# Altium project PowerSupplyPE.PrjPcb
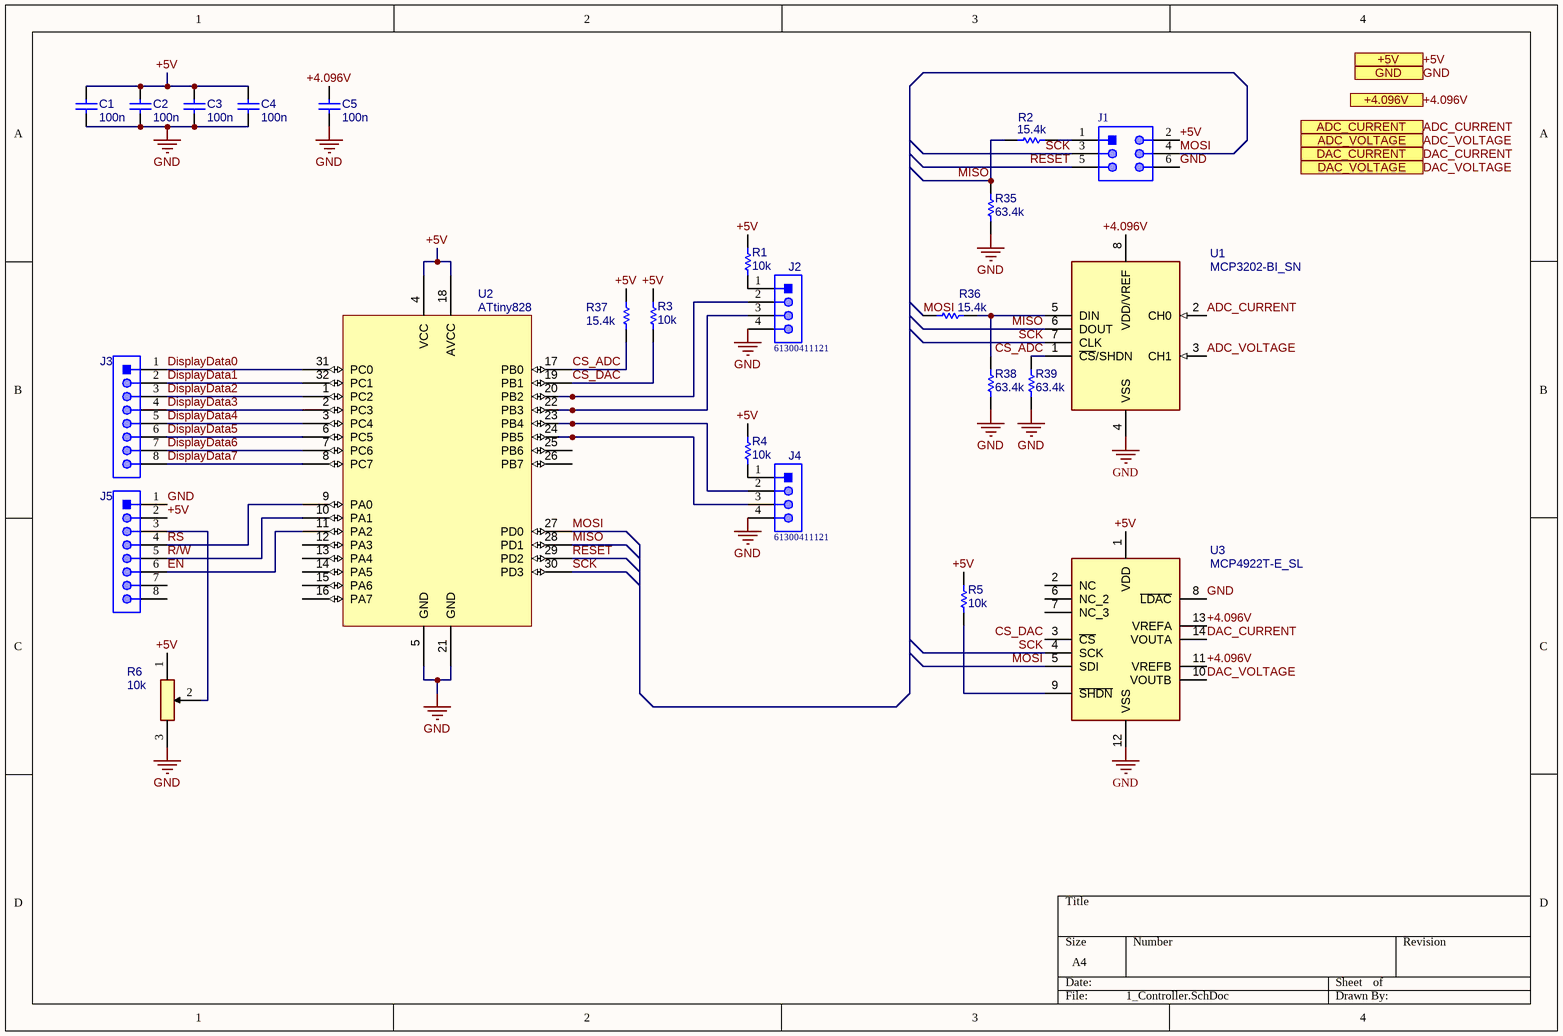
[diagram p0: 1_Controller.SchDoc]
2 sheets, 92 parts. Net scope: flat (ports and power ports of the same name join across sheets).
Board file: PCB1.PcbDoc
Sheets:
  1_Controller.SchDoc
  2_PSU.SchDoc

## Sheet 1_Controller.SchDoc
size A4; SheetNumber: 1; SheetTotal: 2

### Parts
C1  value 100n  [6-0805_N]  (hidden comment: Capacitor)
C2  value 100n  [6-0805_N]  (hidden comment: Capacitor)
C3  value 100n  [6-0805_N]  (hidden comment: Capacitor)
C4  value 100n  [6-0805_N]  (hidden comment: Capacitor)
C5  value 100n  [6-0805_N]  (hidden comment: Capacitor)
J1  61300621121  [61300621121]  (value not drawn)
J2  61300411121  [61300411121]
J3  61300811121  [61300811121]  (value not drawn)
J4  61300411121  [61300411121]
J5  61300811121  [61300811121]  (value not drawn)
R1  value 10k  [6-0805_N]  (hidden comment: Resistor)
R2  value 15.4k  [6-0805_N]  (hidden comment: Resistor)
R3  value 10k  [6-0805_N]  (hidden comment: Resistor)
R4  value 10k  [6-0805_N]  (hidden comment: Resistor)
R5  value 10k  [6-0805_N]  (hidden comment: Resistor)
R6  10k  [PV36W201C01B00]
R35  value 63.4k  [6-0805_N]  (hidden comment: Resistor)
R36  value 15.4k  [6-0805_N]  (hidden comment: Resistor)
R37  value 15.4k  [6-0805_N]  (hidden comment: Resistor)
R38  value 63.4k  [6-0805_N]  (hidden comment: Resistor)
R39  value 63.4k  [6-0805_N]  (hidden comment: Resistor)
U1  MCP3202-BI_SN  [SOIC127P600X175-8N]
U2  ATtiny828  [QFP80P900X900X120-32N]
U3  MCP4922T-E_SL  [SOIC127P600X175-14N]

### Ports
+4.096V (see 2_PSU[4A]), +5V (see 2_PSU[4A]), ADC_CURRENT (see 2_PSU[4A]), ADC_VOLTAGE (see 2_PSU[4A]), DAC_CURRENT (see 2_PSU[4A]), DAC_VOLTAGE (see 2_PSU[4A]), GND (see 2_PSU[4A])

### Nets
GND: C1.1 C2.1 C3.1 C4.1 C5.1 J1.6 J2.4 J4.4 J5.1 R6.3(CW) R35.1 R38.1 R39.1 U1.4(VSS) U2.5(GND) U2.21(GND) U3.8(~{LDAC}) U3.12(VSS) ; port GND
+4.096V: C5.2 U1.8(VDD/VREF) U3.11(VREFB) U3.13(VREFA) ; port +4.096V
+5V: C1.2 C2.2 C3.2 C4.2 J1.2 J5.2 R1.2 R3.2 R4.2 R5.2 R6.1(CCW) R37.1 U2.4(VCC) U2.18(AVCC) U3.1(VDD) ; port +5V
ADC_CURRENT: U1.2(CH0) ; port ADC_CURRENT
ADC_VOLTAGE: U1.3(CH1) ; port ADC_VOLTAGE
CS_ADC: R37.2 R39.2 U1.1(~{CS}/SHDN) U2.17(PB0)
CS_DAC: R3.1 U2.19(PB1) U3.3(~{CS})
DAC_CURRENT: U3.14(VOUTA) ; port DAC_CURRENT
DAC_VOLTAGE: U3.10(VOUTB) ; port DAC_VOLTAGE
DisplayData0: J3.1 U2.31(PC0)
DisplayData1: J3.2 U2.32(PC1)
DisplayData2: J3.3 U2.1(PC2)
DisplayData3: J3.4 U2.2(PC3)
DisplayData4: J3.5 U2.3(PC4)
DisplayData5: J3.6 U2.6(PC5)
DisplayData6: J3.7 U2.7(PC6)
DisplayData7: J3.8 U2.8(PC7)
EN: J5.6 U2.11(PA2)
MISO: R2.2 R35.2 U1.6(DOUT) U2.28(PD1)
MOSI: J1.4 R36.2 U2.27(PD0) U3.5(SDI)
R/W: J5.5 U2.10(PA1)
RESET: J1.5 U2.29(PD2)
RS: J5.4 U2.9(PA0)
SCK: J1.3 U1.7(CLK) U2.30(PD3) U3.4(SCK)
NetJ1_1: J1.1 R2.1
NetJ2_1: J2.1 R1.1
NetJ2_2: J2.2 U2.20(PB2)
NetJ2_3: J2.3 U2.22(PB3)
NetJ4_1: J4.1 R4.1
NetJ4_2: J4.2 U2.23(PB4)
NetJ4_3: J4.3 U2.24(PB5)
NetJ5_3: J5.3 R6.2(WIPER)
NetR5_1: R5.1 U3.9(~{SHDN})
NetR36_1: R36.1 R38.2 U1.5(DIN)

Not connected (* = marked no-connect by the designer): J5 7 8; U2 12(PA3) 13(PA4) 14(PA5) 15(PA6) 16(PA7) 25(PB6) 26(PB7); U3 2(NC) 6(NC_2) 7(NC_3)

### Library data of the parts
C1-C5 = Capacitor: SimulationGenericComponent: True
J1 = CMP-1502-01072-1: THT Vertical Pin Header WR-PHD, Pitch 2.54 mm, Dual Row, 6 pins; Manufacturer: Wurth Elektronik; Contact Resistance: 20mOhm; Withstanding Voltage: 500VAC; Pin Number: 6; Gender: Male; Pitch: 2.54mm; Working Voltage: 250VAC; Rated Current: 3A; Packaging: Bag; Row Number: Dual; Manufacturer URL: http://www.we-online.de; Part Number: 61300621121; Operating Temperature: -40to105degC; Mounting Technology: THT; Package Reference: 61300621121; Datasheet URL: https://katalog.we-online.de/em/datasheet/6130xx21121.pdf; Orientation: Vertical; Publisher: WurthElektronik
J2 J4 = CMP-1502-01064-1: THT Vertical Pin Header WR-PHD, Pitch 2.54 mm, Single Row, 4 pins; Manufacturer: Wurth Elektronik; Withstanding Voltage: 500VAC; Rated Current: 3A; Working Voltage: 250VAC; Pin Number: 4; Gender: Male; Contact Resistance: 20mOhm; Pitch: 2.54mm; Manufacturer URL: http://www.we-online.de; Operating Temperature: -40to105degC; Packaging: Bag; Mounting Technology: THT; Package Reference: 61300411121; Datasheet URL: https://katalog.we-online.de/em/datasheet/6130xx11121.pdf; Publisher: WurthElektronik; Part Number: 61300411121; Row Number: Single; Orientation: Vertical
J3 J5 = CMP-1502-01076-1: THT Vertical Pin Header WR-PHD, Pitch 2.54 mm, Single Row, 8 pins; Manufacturer: Wurth Elektronik; Rated Current: 3A; Pin Number: 8; Working Voltage: 250VAC; Gender: Male; Contact Resistance: 20mOhm; Pitch: 2.54mm; Withstanding Voltage: 500VAC; Publisher: WurthElektronik; Operating Temperature: -40to105degC; Orientation: Vertical; Row Number: Single; Part Number: 61300811121; Package Reference: 61300811121; Mounting Technology: THT; Packaging: Bag; Manufacturer URL: http://www.we-online.de; Datasheet URL: https://katalog.we-online.de/em/datasheet/6130xx11121.pdf
R1-R5 R35-R39 = Resistor: TC1: 0; SimulationGenericComponent: True; TC2: 0
R6 = PV36W104C01B00: Variable Resistor; Manufacturer_Name: Bourns; Datasheet Link: https://www.bourns.com/docs/Product-Datasheets/pv36.pdf; Height: 10.03mm; Manufacturer_Part_Number: PV36W104C01B00; Mouser Part Number: 81-PV36W104C01B00; Mouser Price/Stock: https://www.mouser.co.uk/ProductDetail/Bourns/PV36W104C01B00?qs=ifmdR88tEJ9s2DMKM%252Bry%252BA%3D%3D; Arrow Part Number: PV36W104C01B00; Arrow Price/Stock: https://www.arrow.com/en/products/pv36w104c01b00/bourns?region=nac
U1 = MCP3202-BI_SN: Integrated Circuit; Manufacturer_Name: Microchip; Manufacturer_Part_Number: MCP3202-BI/SN; Datasheet Link: https://datasheet.datasheetarchive.com/originals/distributors/Datasheets-19/DSA-360813.pdf; Height: 1.75mm; Mouser Part Number: 579-MCP3202BISN; Mouser Price/Stock: https://www.mouser.co.uk/ProductDetail/Microchip-Technology-Atmel/MCP3202-BI-SN?qs=C%252BuF95oynlkGMhp5%2FSqbew%3D%3D; Arrow Part Number: MCP3202-BI/SN; Arrow Price/Stock: https://www.arrow.com/en/products/mcp3202-bisn/microchip-technology?region=nac
U2 = ATtiny828: Microchip ATtiny828 AVR MCU
U3 = MCP4922T-E_SL: Undefined or Miscellaneous; Manufacturer_Name: Microchip; Manufacturer_Part_Number: MCP4922T-E/SL; Datasheet Link: http://ww1.microchip.com/downloads/en/DeviceDoc/22250A.pdf; Height: 1.75mm; Mouser Part Number: 579-MCP4922T-E/SL; Mouser Price/Stock: https://www.mouser.co.uk/ProductDetail/Microchip-Technology-Atmel/MCP4922T-E-SL?qs=8U9qMIGhlkqc26Xt7UKk2w%3D%3D; Arrow Part Number: MCP4922T-E/SL; Arrow Price/Stock: https://www.arrow.com/en/products/mcp4922t-esl/microchip-technology?region=nac

## Sheet 2_PSU.SchDoc
size A4; SheetNumber: 2; SheetTotal: 2
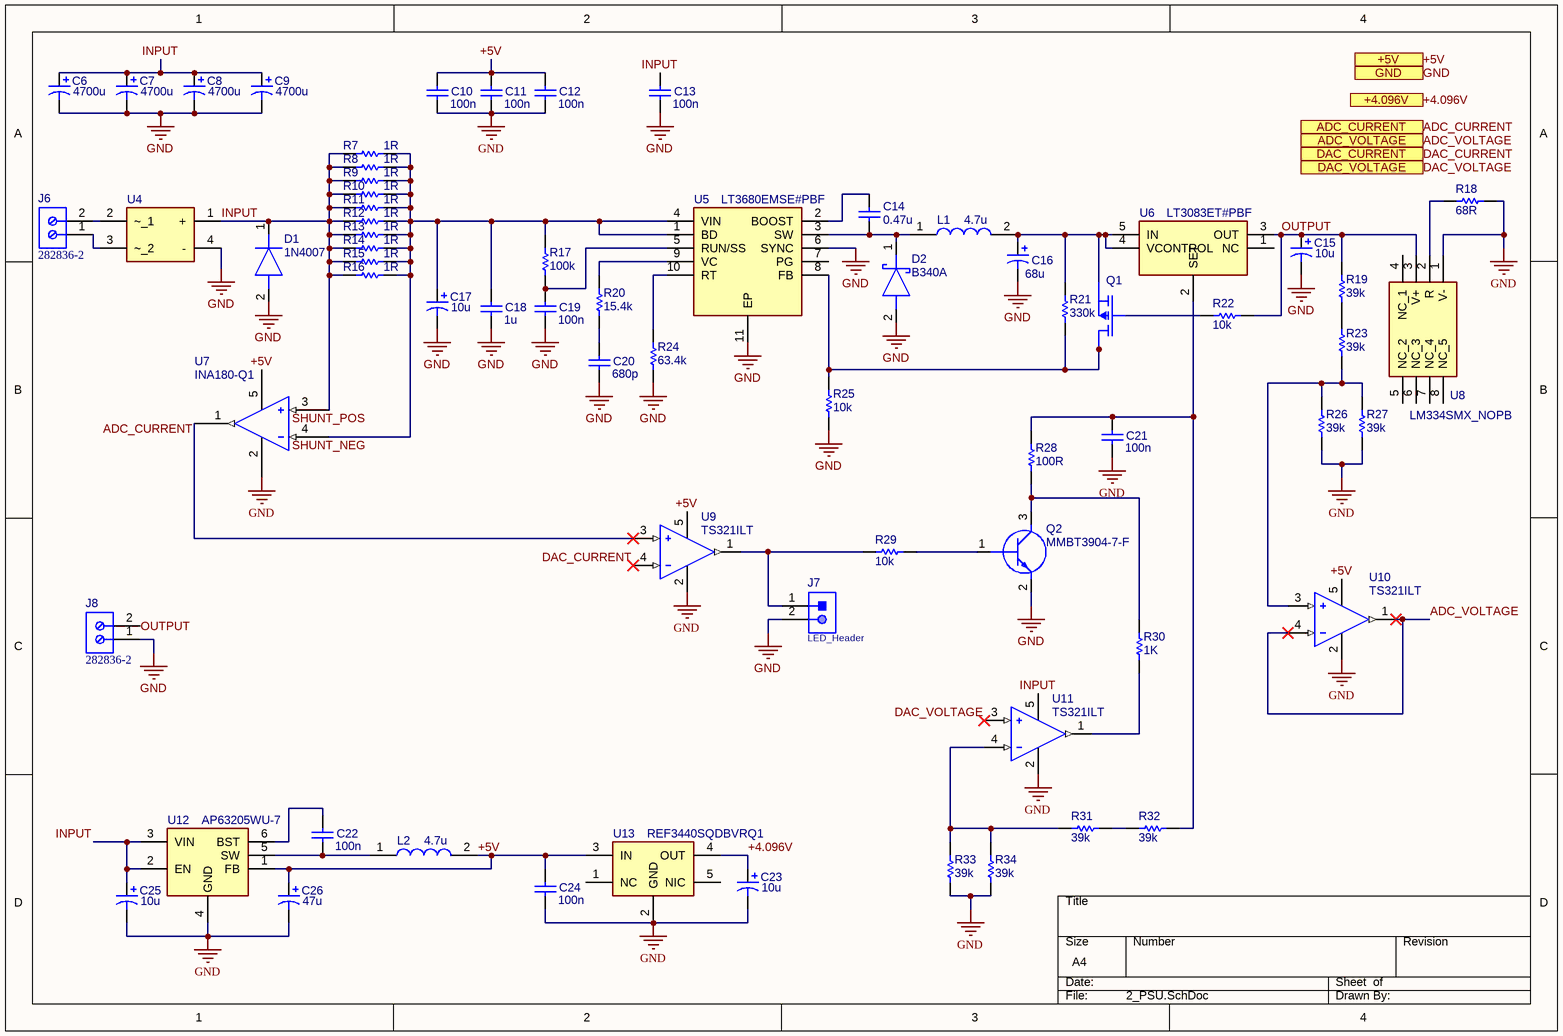
[diagram p1: 2_PSU.SchDoc]

### Parts
C6  value 4700u  [CAPPRD750W80D1850H4150]  (hidden comment: Cap Pol1)
C7  value 4700u  [CAPPRD750W80D1850H4150]  (hidden comment: Cap Pol1)
C8  value 4700u  [CAPPRD750W80D1850H4150]  (hidden comment: Cap Pol1)
C9  value 4700u  [CAPPRD750W80D1850H4150]  (hidden comment: Cap Pol1)
C10  value 100n  [6-0805_N]  (hidden comment: Capacitor)
C11  value 100n  [6-0805_N]  (hidden comment: Capacitor)
C12  value 100n  [6-0805_N]  (hidden comment: Capacitor)
C13  value 100n  [6-0805_N]  (hidden comment: Capacitor)
C14  value 0.47u  [6-0805_N]  (hidden comment: Capacitor)
C15  value 10u  [CAPPRD200W52D500H1250]  (hidden comment: Cap Pol1)
C16  value 68u  [CAPPRD250W52D630H1100]  (hidden comment: Cap Pol1)
C17  value 10u  [CAPPRD200W52D500H1250]  (hidden comment: Cap Pol1)
C18  value 1u  [6-0805_N]  (hidden comment: Capacitor)
C19  value 100n  [6-0805_N]  (hidden comment: Capacitor)
C20  value 680p  [6-0805_N]  (hidden comment: Capacitor)
C21  value 100n  [6-0805_N]  (hidden comment: Capacitor)
C22  value 100n  [6-0805_N]  (hidden comment: Capacitor)
C23  value 10u  [CAPPRD200W52D500H1250]  (hidden comment: Cap Pol1)
C24  value 100n  [6-0805_N]  (hidden comment: Capacitor)
C25  value 10u  [CAPPRD200W52D500H1250]  (hidden comment: Cap Pol1)
C26  value 47u  [CAPPRD200W52D500H1250]  (hidden comment: Cap Pol1)
D1  1N4007  [DIOAD1405W58L465D235]
D2  B340A  [DIOM5127X229N]
J6  282836-2  [TECO-282836-2_V]
J7  LED_Header  [61300211121]
J8  282836-2  [TECO-282836-2_V]
L1  4.7u  [VLS5045EX330M]
L2  4.7u  [VLS5045EX330M]
Q1  ZVP4525GTA  [SOT230P700X180-4N]  (value not drawn)
Q2  MMBT3904-7-F  [SOT96P240X110-3N]
R7  value 1R  [6-0805_N]  (hidden comment: Resistor)
R8  value 1R  [6-0805_N]  (hidden comment: Resistor)
R9  value 1R  [6-0805_N]  (hidden comment: Resistor)
R10  value 1R  [6-0805_N]  (hidden comment: Resistor)
R11  value 1R  [6-0805_N]  (hidden comment: Resistor)
R12  value 1R  [6-0805_N]  (hidden comment: Resistor)
R13  value 1R  [6-0805_N]  (hidden comment: Resistor)
R14  value 1R  [6-0805_N]  (hidden comment: Resistor)
R15  value 1R  [6-0805_N]  (hidden comment: Resistor)
R16  value 1R  [6-0805_N]  (hidden comment: Resistor)
R17  value 100k  [6-0805_N]  (hidden comment: Resistor)
R18  value 68R  [6-0805_N]  (hidden comment: Resistor)
R19  value 39k  [6-0805_N]  (hidden comment: Resistor)
R20  value 15.4k  [6-0805_N]  (hidden comment: Resistor)
R21  value 330k  [6-0805_N]  (hidden comment: Resistor)
R22  value 10k  [6-0805_N]  (hidden comment: Resistor)
R23  value 39k  [6-0805_N]  (hidden comment: Resistor)
R24  value 63.4k  [6-0805_N]  (hidden comment: Resistor)
R25  value 10k  [6-0805_N]  (hidden comment: Resistor)
R26  value 39k  [6-0805_N]  (hidden comment: Resistor)
R27  value 39k  [6-0805_N]  (hidden comment: Resistor)
R28  value 100R  [6-0805_N]  (hidden comment: Resistor)
R29  value 10k  [6-0805_N]  (hidden comment: Resistor)
R30  value 1K  [6-0805_N]  (hidden comment: Resistor)
R31  value 39k  [6-0805_N]  (hidden comment: Resistor)
R32  value 39k  [6-0805_N]  (hidden comment: Resistor)
R33  value 39k  [6-0805_N]  (hidden comment: Resistor)
R34  value 39k  [6-0805_N]  (hidden comment: Resistor)
U4  GBU1010_T0_00601  [GBU1010_T0_00601]  (value not drawn)
U5  LT3680EMSE#PBF  [SOP50P490X110-11N]
U6  LT3083ET#PBF  [TO170P457X1022X2306-5P]
U7  INA180-Q1  [SOT95P280X145-5N]
U8  LM334SMX_NOPB  [SOIC127P600X175-8N]
U9  TS321ILT  [SOT95P280X145-5N]
U10  TS321ILT  [SOT95P280X145-5N]
U11  TS321ILT  [SOT95P280X145-5N]
U12  AP63205WU-7  [SOT95P280X100-6N]
U13  REF3440SQDBVRQ1  [SOT95P280X145-5N]

### Ports
+4.096V (see 1_Controller[4A]), +5V (see 1_Controller[4A]), ADC_CURRENT (see 1_Controller[4A]), ADC_VOLTAGE (see 1_Controller[4A]), DAC_CURRENT (see 1_Controller[4A]), DAC_VOLTAGE (see 1_Controller[4A]), GND (see 1_Controller[4A])

### Nets
GND: C6.2 C7.2 C8.2 C9.2 C10.1 C11.1 C12.1 C13.1 C15.2 C16.2 C17.2 C18.1 C19.1 C20.1 C21.1 C23.2 C24.1 C25.2 C26.2 D1.2(A) D2.2(A) J7.2 J8.1 Q2.2(E) R18.1 R24.1 R25.1 R26.1 R27.1 R33.1 R34.1 U4.4(-) U5.6(SYNC) U5.11(EP) U7.2(GND) U8.1(V-) U9.2(VCC-) U10.2(VCC-) U11.2(VCC-) U12.4(GND) U13.2(GND) ; port GND
+4.096V: C23.1 U13.4(OUT) ; port +4.096V
+5V: C10.2 C11.2 C12.2 C24.2 C26.1 L2.2 U7.5(VS) U9.5(VCC+) U10.5(VCC+) U12.1(FB) U13.3(IN) ; port +5V
ADC_CURRENT: U7.1(OUT) U9.3(NON-INVERTING_INPUT) ; port ADC_CURRENT
ADC_VOLTAGE: U10.1(OUTPUT) U10.4(INVERTING_INPUT) ; port ADC_VOLTAGE
DAC_CURRENT: U9.4(INVERTING_INPUT) ; port DAC_CURRENT
DAC_VOLTAGE: U11.3(NON-INVERTING_INPUT) ; port DAC_VOLTAGE
INPUT: C6.1 C7.1 C8.1 C9.1 C13.2 C25.1 D1.1(K) R7.1 R8.1 R9.1 R10.1 R11.1 R12.1 R13.1 R14.1 R15.1 R16.1 U4.1(+) U7.3(IN+) U11.5(VCC+) U12.2(EN) U12.3(VIN)  [also labelled SHUNT_POS]
OUTPUT: C15.1 J8.2 R19.2 R22.1 U6.3(OUT) U8.3(V+)
SHUNT_NEG: C17.1 C18.2 R7.2 R8.2 R9.2 R10.2 R11.2 R12.2 R13.2 R14.2 R15.2 R16.2 R17.2 U5.1(BD) U5.4(VIN) U7.4(IN-)
NetC14_1: C14.1 D2.1(K) L1.1 U5.3(SW)
NetC14_2: C14.2 U5.2(BOOST)
NetC16_1: C16.1 L1.2 Q1.3(S) R21.2 U6.4(VCONTROL) U6.5(IN)
NetC19_2: C19.2 R17.1 U5.5(RUN/SS)
NetC20_2: C20.2 R20.1
NetC21_2: C21.2 R28.2 R32.1 U6.2(SET)
NetC22_1: C22.1 L2.1 U12.5(SW)
NetC22_2: C22.2 U12.6(BST)
NetJ6_1: J6.1 U4.3(~_2)
NetJ6_2: J6.2 U4.2(~_1)
NetJ7_1: J7.1 R29.1 U9.1(OUTPUT)
NetQ1_1: Q1.1(G) R22.2
NetQ1_2: Q1.2(D_1) Q1.4(D_2) R21.1 R25.2 U5.8(FB)
NetQ2_1: Q2.1(B) R29.2
NetQ2_3: Q2.3(C) R28.1 R30.2
NetR18_2: R18.2 U8.2(R)
NetR19_1: R19.1 R23.2
NetR20_2: R20.2 U5.9(VC)
NetR23_1: R23.1 R26.2 R27.2 U10.3(NON-INVERTING_INPUT)
NetR24_2: R24.2 U5.10(RT)
NetR30_1: R30.1 U11.1(OUTPUT)
NetR31_1: R31.1 R32.2
NetR31_2: R31.2 R33.2 R34.2 U11.4(INVERTING_INPUT)

Not connected (* = marked no-connect by the designer): U5 7(PG); U6 1(NC); U8 4(NC_1) 5(NC_2) 6(NC_3) 7(NC_4) 8(NC_5); U13 1(NC) 5(NIC)

### Library data of the parts
C6-C9 C15-C17 C23 C25 C26 = Cap Pol1: Polarized Capacitor (Radial); Published: 8-Jun-2000; LatestRevisionDate: 17-Jul-2002; LatestRevisionNote: Re-released for DXP Platform.; PackageReference: RB7.6-15; Publisher: Altium Limited; PackageDescription: Polarized Capacitor (Radial); 2 Leads
C10-C14 C18-C22 C24 = Capacitor: SimulationGenericComponent: True
D1 = 1N4007: Diode; Manufacturer_Name: Diotec; Datasheet Link: https://diotec.com/tl_files/diotec/files/pdf/datasheets/1n4001.pdf; Manufacturer_Part_Number: 1N4007; Mouser Part Number: 637-1N4007; Mouser Price/Stock: https://www.mouser.co.uk/ProductDetail/Diotec-Semiconductor/1N4007?qs=OlC7AqGiEDmK9mU1uTiCkg%3D%3D; Arrow Part Number: 1N4007; Arrow Price/Stock: https://www.arrow.com/en/products/1n4007/diotec-semiconductor-ag?region=europe
D2 = B340A-E3_61T: Diode; Manufacturer_Name: Vishay; Manufacturer_Part_Number: B340A-E3/61T; Datasheet Link: https://ms.componentsearchengine.com/Datasheets/2/B340A-E3_61T.pdf; Height: 2.29mm; Mouser Part Number: 625-BD340A-E3/61T; Mouser Price/Stock: https://www.mouser.co.uk/ProductDetail/Vishay-General-Semiconductor/B340A-E3-61T?qs=tdXsjSi%2FIMY4I2dGLbnpzg%3D%3D; Arrow Part Number: B340A-E3/61T; Arrow Price/Stock: https://www.arrow.com/en/products/b340a-e361t/vishay?region=nac
J6 J8 = CMP-1684-00017-1: Female Header, Pitch 5 mm, 1 x 2 Position, Height 10 mm, Tail Length 3.5 mm, Rohs, Bulk; Manufacturer: TE Connectivity; Wire Gauge: 16-30AWG; Product Training Modules: Wire-to-BoardEurostyleTerminalBlocks; Clamp Material - Plating: Brass-NickelPlated; Voltage: 300V; Mating Orientation: HorizontalwithBoard; Current: 13.5A; Pitch: 0.197"(5.00mm); Screw Thread: M3; 3D Model: 282836-2.pdf; Other Names: 5ULV-02B / A98076; Dynamic Catalog: BuchananSeries; Number of Levels: 1; Torque - Screw: 0.68Nm(6Lb-In); Featured Product: EurostyleTerminalBlockConnectors; Positions Per Level: 2; Wire Termination: Screw-RisingCageClamp; Datasheet URL: http://www.te.com.cn/commerce/DocumentDelivery/DDEController?Action=showdoc&DocId=Catalog+Section%7F1308389_EUROSTYLE_TERMINAL_BLOCKS%7F0607%7Fpdf%7FEnglish%7FENG_CS_1308389_EUROSTYLE_TERMINAL_BLOCKS_0607.pdf%7F282836-2; Color: Green; Family: TerminalBlocks-WiretoBoard; RoHS Information: 282836-2StatementofCompliance; Standard Package: 300; Contact Material - Plating: Brass-TinPlated; Manufacturer URL: http://www.te.com; Housing Material: Polyamide(PA66),Nylon6/6; Features: Interlocking(Side); Package Description: Female Header, Pitch 5 mm, 1 x 2 Position, Height 10 mm, Tail Length 3.5 mm; Mounting Type: ThroughHole; Package Reference: THD; Packaging: Bulk; Series: Buchanan; Category: Connectors,Interconnects; Screw Material - Plating: Brass-NickelPlated
J7 = CMP-1712-00002-4: THT Vertical Pin Header WR-PHD, Pitch 2.54 mm, Single Row, 2 pins; Manufacturer: Wurth Elektronik; Rated Current: 3A; Gender: Male; Withstanding Voltage: 500VAC; Working Voltage: 250VAC; Pitch: 2.54mm; Contact Resistance: 20mOhm; Pin Number: 2; Mounting Technology: THT; Orientation: Vertical; Operating Temperature: -40to105degC; Packaging: Bag; Publisher: WurthElektronik; Datasheet URL: https://katalog.we-online.de/em/datasheet/6130xx11121.pdf; Manufacturer URL: http://www.we-online.de; Row Number: Single; Package Reference: 61300211121; Part Number: 61300211121
L1 L2 = VLS5045EX-4R7M-H: Inductor; Manufacturer_Name: TDK; Datasheet Link: https://product.tdk.com/system/files/dam/doc/product/inductor/inductor/smd/catalog/inductor_automotive_power_vls5045ex-h_en.pdf; Height: 4mm; Manufacturer_Part_Number: VLS5045EX-4R7M-H; Mouser Part Number: 810-VLS5045EX-4R7M-H; Mouser Price/Stock: https://www.mouser.co.uk/ProductDetail/TDK/VLS5045EX-4R7M-H?qs=EBDBlbfErPwFg%2FOwn47Q1A%3D%3D; Arrow Part Number: VLS5045EX-4R7M-H; Arrow Price/Stock: https://www.arrow.com/en/products/vls5045ex-4r7m-h/tdk?region=nac
Q1 = ZVP4525GTA: MOSFET (P-Channel); Manufacturer_Name: Diodes Inc.; Datasheet Link: https://www.diodes.com/assets/Datasheets/ZVP4525G.pdf; Height: 1.8mm; Manufacturer_Part_Number: ZVP4525GTA; Mouser Part Number: 522-ZVP4525GTA; Mouser Price/Stock: https://www.mouser.co.uk/ProductDetail/Diodes-Incorporated/ZVP4525GTA?qs=GedFDFLaBXFR8NEzssRbSQ%3D%3D; Arrow Part Number: ZVP4525GTA; Arrow Price/Stock: https://www.arrow.com/en/products/zvp4525gta/diodes-incorporated?region=nac
Q2 = MMBT3904-7-F: Transistor BJT NPN; Manufacturer_Name: Diodes Inc.; Datasheet Link: https://www.arrow.com/en/products/mmbt3904-7-f/diodes-incorporated; Height: 1.1mm; Manufacturer_Part_Number: MMBT3904-7-F; Mouser Part Number: 621-MMBT3904-F; Mouser Price/Stock: https://www.mouser.co.uk/ProductDetail/Diodes-Incorporated/MMBT3904-7-F?qs=7F%2FY8wl6X3H3eL7tHVWSBQ%3D%3D; Arrow Part Number: MMBT3904-7-F; Arrow Price/Stock: https://www.arrow.com/en/products/mmbt3904-7-f/diodes-incorporated?region=nac
R7-R34 = Resistor: TC1: 0; SimulationGenericComponent: True; TC2: 0
U4 = GBU1010_T0_00601: Bridge Rectifier; Manufacturer_Name: PANJIT; Datasheet Link: https://www.panjit.com.tw/upload/datasheet/GBU1010.pdf; Height: 21.55mm; Manufacturer_Part_Number: GBU1010_T0_00601; Mouser Part Number: 241-GBU1010_T0_00601; Mouser Price/Stock: https://www.mouser.co.uk/ProductDetail/Panjit/GBU1010_T0_00601?qs=Znm5pLBrcAI2lNvio7iUfQ%3D%3D
U5 = LT3680EMSE#PBF: Integrated Circuit; Manufacturer_Name: Analog Devices; Datasheet Link: http://cds.linear.com/docs/en/datasheet/3680fb.pdf; Height: 1.1mm; Manufacturer_Part_Number: LT3680EMSE#PBF; Mouser Part Number: 584-LT3680EMSE#PBF; Mouser Price/Stock: https://www.mouser.co.uk/ProductDetail/Analog-Devices/LT3680EMSEPBF?qs=hVkxg5c3xu84NF9L1FMYWA%3D%3D; Arrow Part Number: LT3680EMSE#PBF; Arrow Price/Stock: https://www.arrow.com/en/products/lt3680emsepbf/analog-devices?region=nac
U6 = LT3083ET#PBF: Integrated Circuit; Manufacturer_Name: Analog Devices; Datasheet Link: http://www.linear.com/docs/30239; Height: 4.572mm; Manufacturer_Part_Number: LT3083ET#PBF; Mouser Part Number: 584-LT3083ET#PBF; Mouser Price/Stock: https://www.mouser.co.uk/ProductDetail/Analog-Devices/LT3083ETPBF?qs=hVkxg5c3xu%252BEQibxnmC0QQ%3D%3D; Arrow Part Number: LT3083ET#PBF; Arrow Price/Stock: https://www.arrow.com/en/products/lt3083etpbf/linear-technology
U7 = INA180-Q1: Current Sense Amplifier
U8 = LM334SMX_NOPB: Integrated Circuit; Manufacturer_Name: Texas Instruments; Manufacturer_Part_Number: LM334SMX/NOPB; Datasheet Link: http://www.ti.com/lit/gpn/LM334; Height: 1.75mm; Mouser Part Number: 926-LM334SMX/NOPB; Mouser Price/Stock: https://www.mouser.co.uk/ProductDetail/Texas-Instruments/LM334SMX-NOPB?qs=X1J7HmVL2ZF1HSorCNkgVw%3D%3D; Arrow Part Number: LM334SMX/NOPB; Arrow Price/Stock: https://www.arrow.com/en/products/lm334smxnopb/texas-instruments?region=nac
U9-U11 = TS321ILT: Integrated Circuit; Manufacturer_Name: STMicroelectronics; Datasheet Link: http://www.st.com/st-web-ui/static/active/en/resource/technical/document/datasheet/CD00001647.pdf; Height: 1.45mm; Manufacturer_Part_Number: TS321ILT; Mouser Part Number: 511-TS321IL; Mouser Price/Stock: https://www.mouser.co.uk/ProductDetail/STMicroelectronics/TS321ILT?qs=AYLkW%2FmgjI3DImBJVY6kBw%3D%3D; Arrow Part Number: TS321ILT; Arrow Price/Stock: https://www.arrow.com/en/products/ts321ilt/stmicroelectronics?region=europe
U12 = AP63205WU-7: Integrated Circuit; Manufacturer_Name: Diodes Inc.; Datasheet Link: https://www.diodes.com/assets/Datasheets/AP63200-AP63201-AP63203-AP63205.pdf; Height: 1mm; Manufacturer_Part_Number: AP63205WU-7; Mouser Part Number: 621-AP63205WU-7; Mouser Price/Stock: https://www.mouser.co.uk/ProductDetail/Diodes-Incorporated/AP63205WU-7?qs=u16ybLDytRZtkj8PzdWCOw%3D%3D; Arrow Part Number: AP63205WU-7; Arrow Price/Stock: https://www.arrow.com/en/products/ap63205wu-7/diodes-incorporated?region=europe
U13 = REF3440SQDBVRQ1: Integrated Circuit; Manufacturer_Name: Texas Instruments; Datasheet Link: https://www.ti.com/lit/gpn/REF34-Q1; Height: 1.45mm; Manufacturer_Part_Number: REF3440SQDBVRQ1; Mouser Part Number: 595-REF3440SQDBVRQ1; Mouser Price/Stock: https://www.mouser.co.uk/ProductDetail/Texas-Instruments/REF3440SQDBVRQ1?qs=bAKSY%2FctAC6om7nW8LpN%2Fg%3D%3D; Arrow Part Number: REF3440SQDBVRQ1; Arrow Price/Stock: https://www.arrow.com/en/products/ref3440sqdbvrq1/texas-instruments?region=nac

## Nets that join several sheets
GND: 1_Controller (18 pins), 2_PSU (41 pins)
+4.096V: 1_Controller (C5.2 U1.8 U3.11 U3.13), 2_PSU (C23.1 U13.4)
+5V: 1_Controller (15 pins), 2_PSU (11 pins)
ADC_CURRENT: 1_Controller (U1.2), 2_PSU (U7.1 U9.3)
ADC_VOLTAGE: 1_Controller (U1.3), 2_PSU (U10.1 U10.4)
DAC_CURRENT: 1_Controller (U3.14), 2_PSU (U9.4)
DAC_VOLTAGE: 1_Controller (U3.10), 2_PSU (U11.3)